# Altium schematic sheet Differential_Amp.SchDoc
size A; SheetNumber: 3; SheetTotal: 4
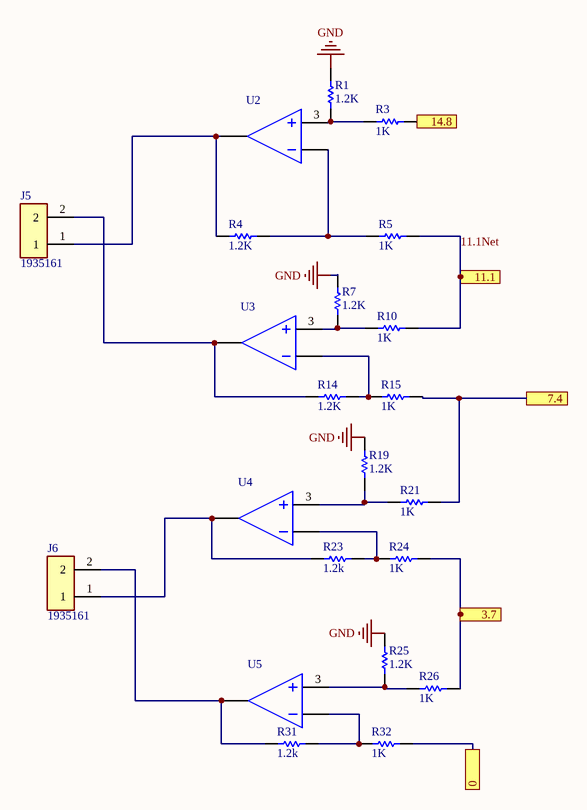
[diagram p0: Differential_Amp.SchDoc]

## Parts
J5  1935161  [PHOENIX_1935161]
J6  1935161  [PHOENIX_1935161]
R1  value 1.2K  [0805]  (hidden comment: Resistor)
R3  value 1K  [0805]  (hidden comment: Resistor)
R4  value 1.2K  [0805]  (hidden comment: Resistor)
R5  value 1K  [0805]  (hidden comment: Resistor)
R7  value 1.2K  [0805]  (hidden comment: Resistor)
R10  value 1K  [0805]  (hidden comment: Resistor)
R14  value 1.2K  [0805]  (hidden comment: Resistor)
R15  value 1K  [0805]  (hidden comment: Resistor)
R19  value 1.2K  [0805]  (hidden comment: Resistor)
R21  value 1K  [0805]  (hidden comment: Resistor)
R23  value 1.2k  [0805]  (hidden comment: Resistor)
R24  value 1K  [0805]  (hidden comment: Resistor)
R25  value 1.2K  [0805]  (hidden comment: Resistor)
R26  value 1K  [0805]  (hidden comment: Resistor)
R31  value 1.2k  [0805]  (hidden comment: Resistor)
R32  value 1K  [0805]  (hidden comment: Resistor)
U2  Ideal Operational Amplifier  [SOT95P280X110-6N]  (value not drawn)
U3  Ideal Operational Amplifier  [SOT95P280X110-6N]  (value not drawn)
U4  Ideal Operational Amplifier  [SOT95P280X110-6N]  (value not drawn)
U5  Ideal Operational Amplifier  [SOT95P280X110-6N]  (value not drawn)

## Ports
0 (see BMS_MAIN[7A], BMS_MAIN[8A]), 3.7 (see BMS_MAIN[7A], BMS_MAIN[8B]), 7.4 (see BMS_MAIN[7A], BMS_MAIN[8B]), 11.1 (see BMS_MAIN[7B]), 14.8 (see BMS_MAIN[7B], Buck[2B])

## Nets
GND: R1.1 R7.1 R19.1 R25.1
0: R32.1 ; port 0
3.7: R24.1 R26.1 ; port 3.7
7.4: R15.1 R21.1 ; port 7.4
11.1Net: R5.1 R10.1 ; port 11.1
14.8: R3.1 ; port 14.8
NetJ5_1: J5.1 R4.2 U2.1(OUT)
NetJ5_2: J5.2 R14.2 U3.1(OUT)
NetJ6_1: J6.1 R23.2 U4.1(OUT)
NetJ6_2: J6.2 R31.2 U5.1(OUT)
NetR1_2: R1.2 R3.2 U2.3(IN+)
NetR4_1: R4.1 R5.2 U2.4(IN-)
NetR7_2: R7.2 R10.2 U3.3(IN+)
NetR14_1: R14.1 R15.2 U3.4(IN-)
NetR19_2: R19.2 R21.2 U4.3(IN+)
NetR23_1: R23.1 R24.2 U4.4(IN-)
NetR25_2: R25.2 R26.2 U5.3(IN+)
NetR31_1: R31.1 R32.2 U5.4(IN-)

## Library data of the parts
J5 J6 = 1935161: Conn Terminal Blocks 2 POS 5mm Solder ST Thru-Hole 16A; MF: {'manufacturer': u'Phoenix Contact'}; Package: None; MP: 1935161; Value: *; Price: None; Availability: Unavailable
R1 R3-R5 R7 R10 R14 R15 R19 R21 R23-R26 R31 R32 = Resistor: TC1: 0; SimulationGenericComponent: True; TC2: 0
U2-U5 = OpAmp: SimulationGenericComponent: True; GAIN: 1Meg